# Altium schematic sheet 88路激光器工程.SchDoc: Laser Driver Board 01
size A2; Revision: V01; SheetNumber: 1; SheetTotal: 3; DocStatus: Draft
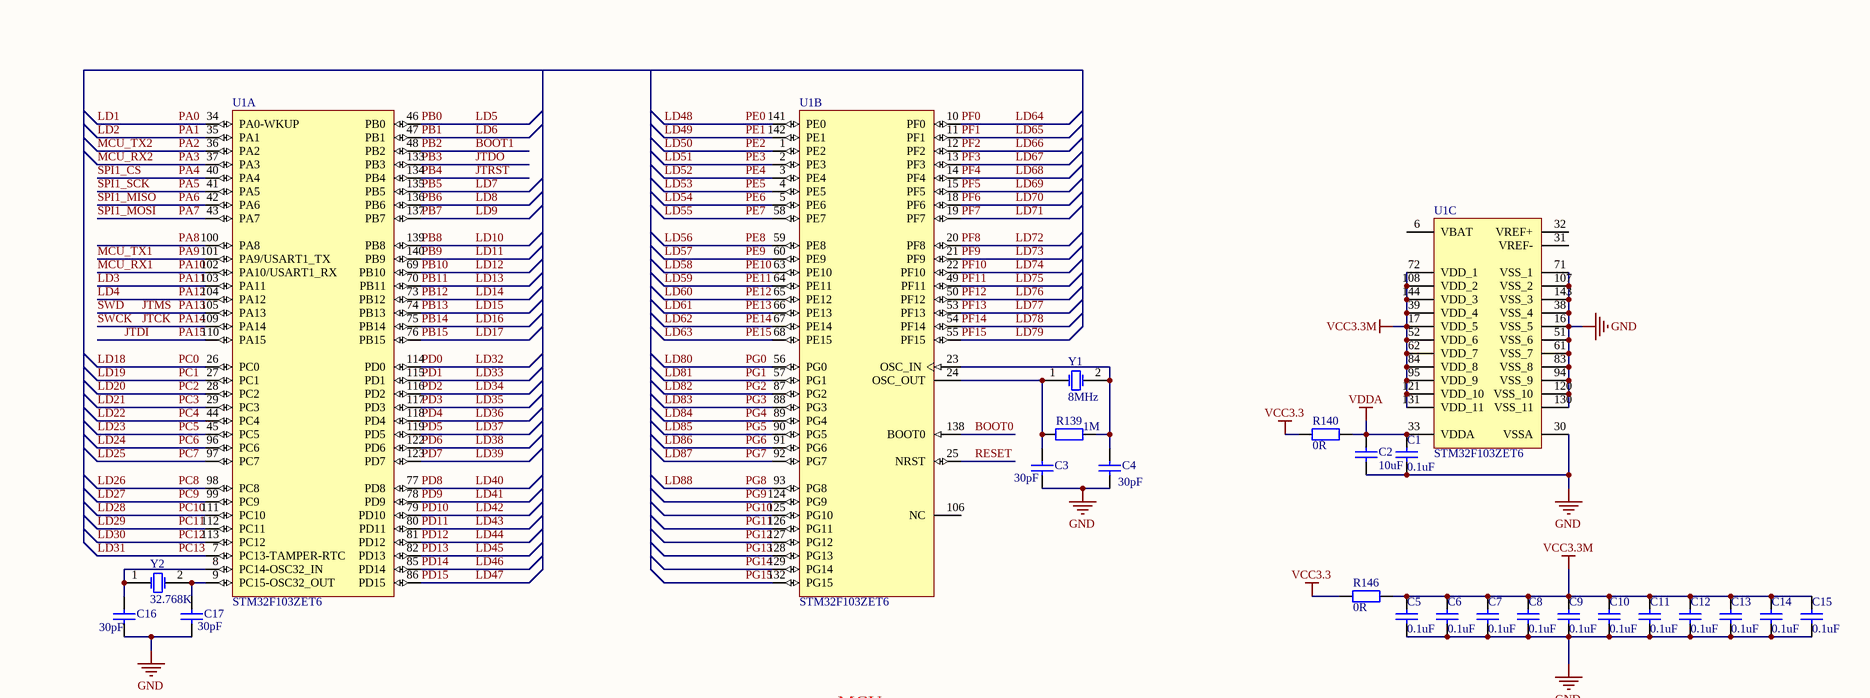
[diagram p0: 88路激光器工程.SchDoc, top left]
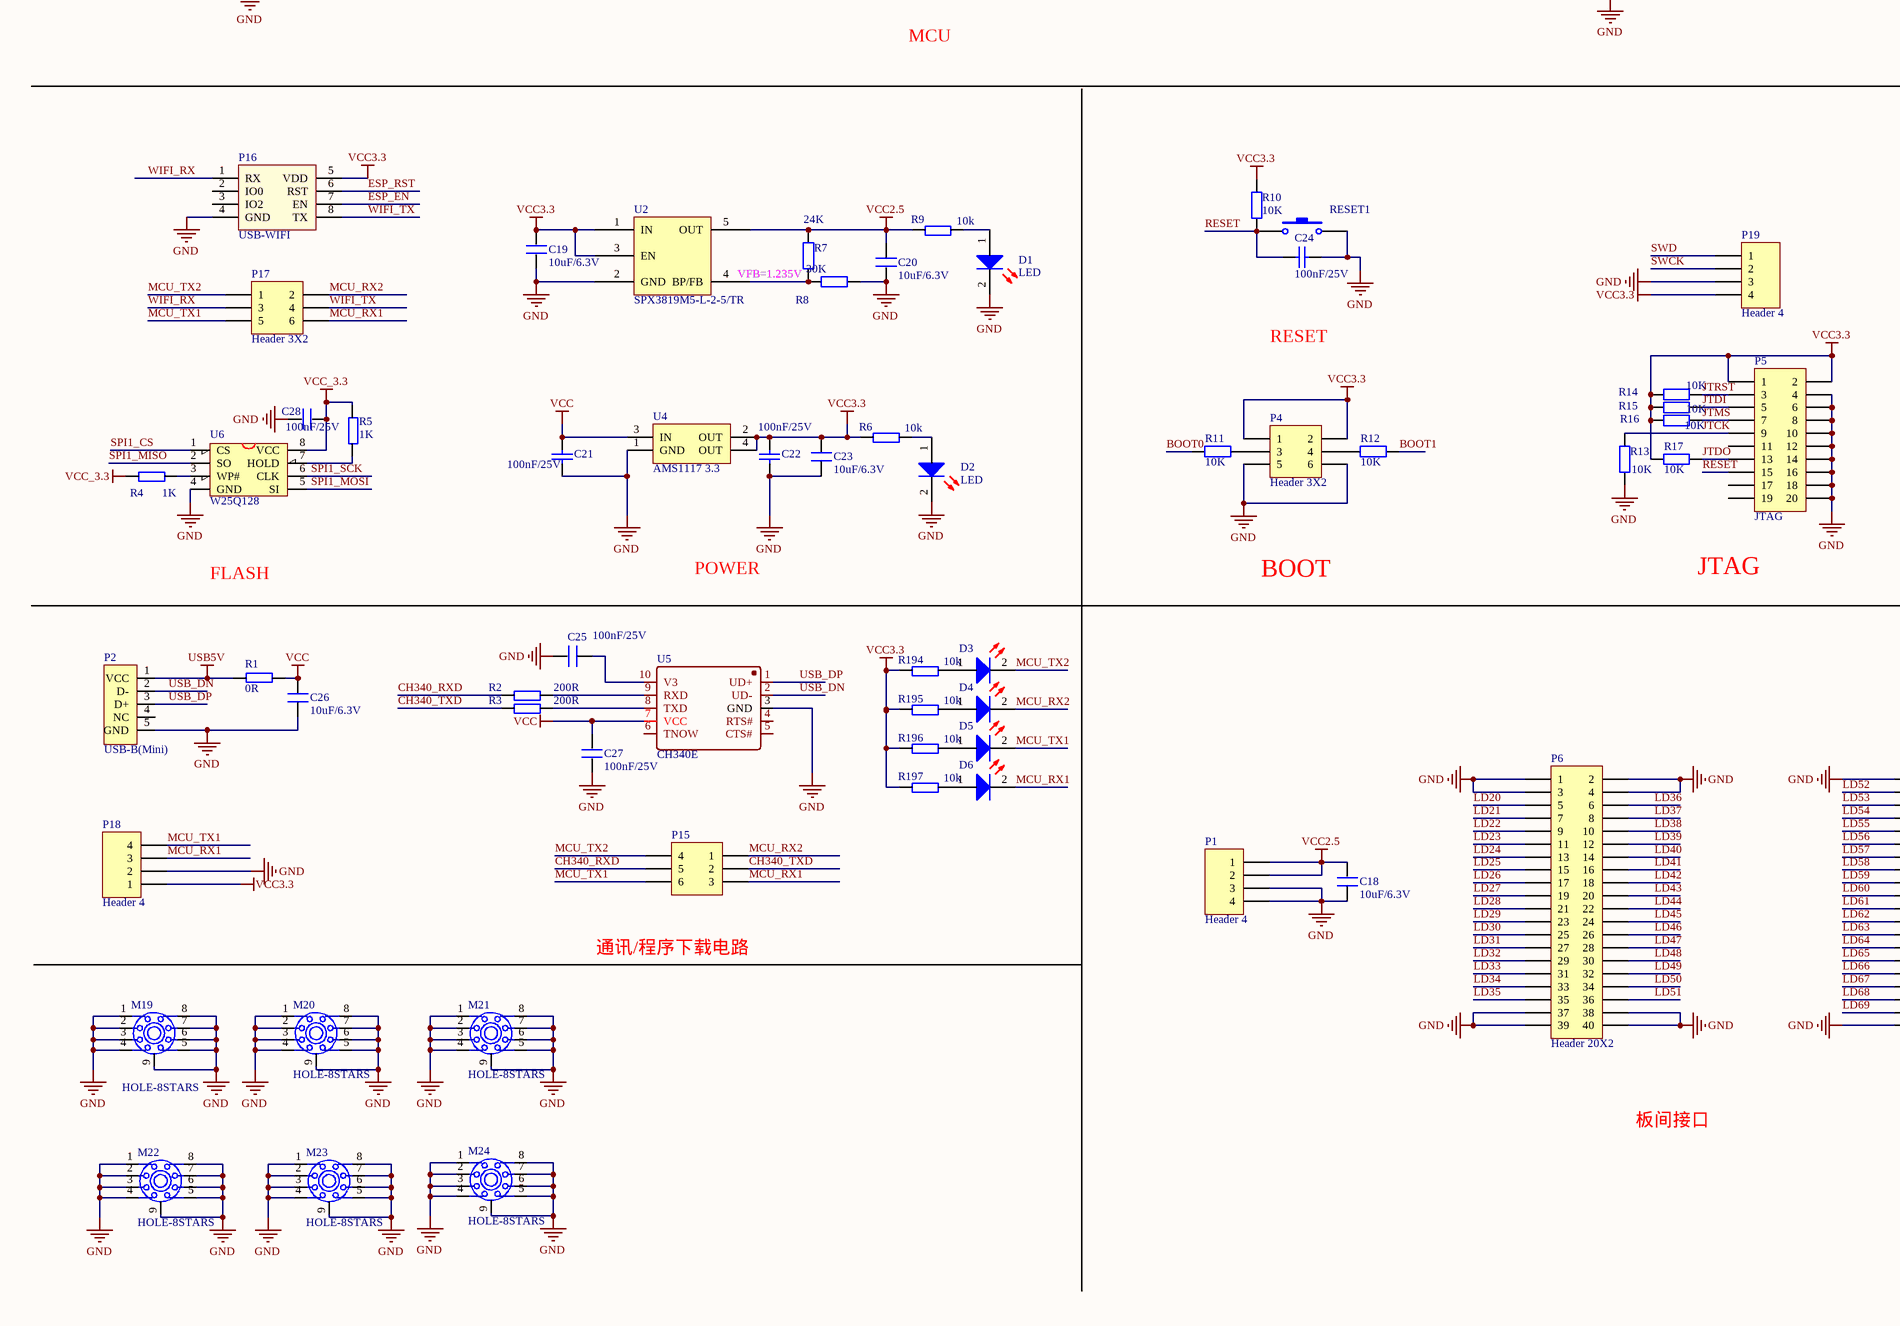
[diagram p1: 88路激光器工程.SchDoc, bottom left]
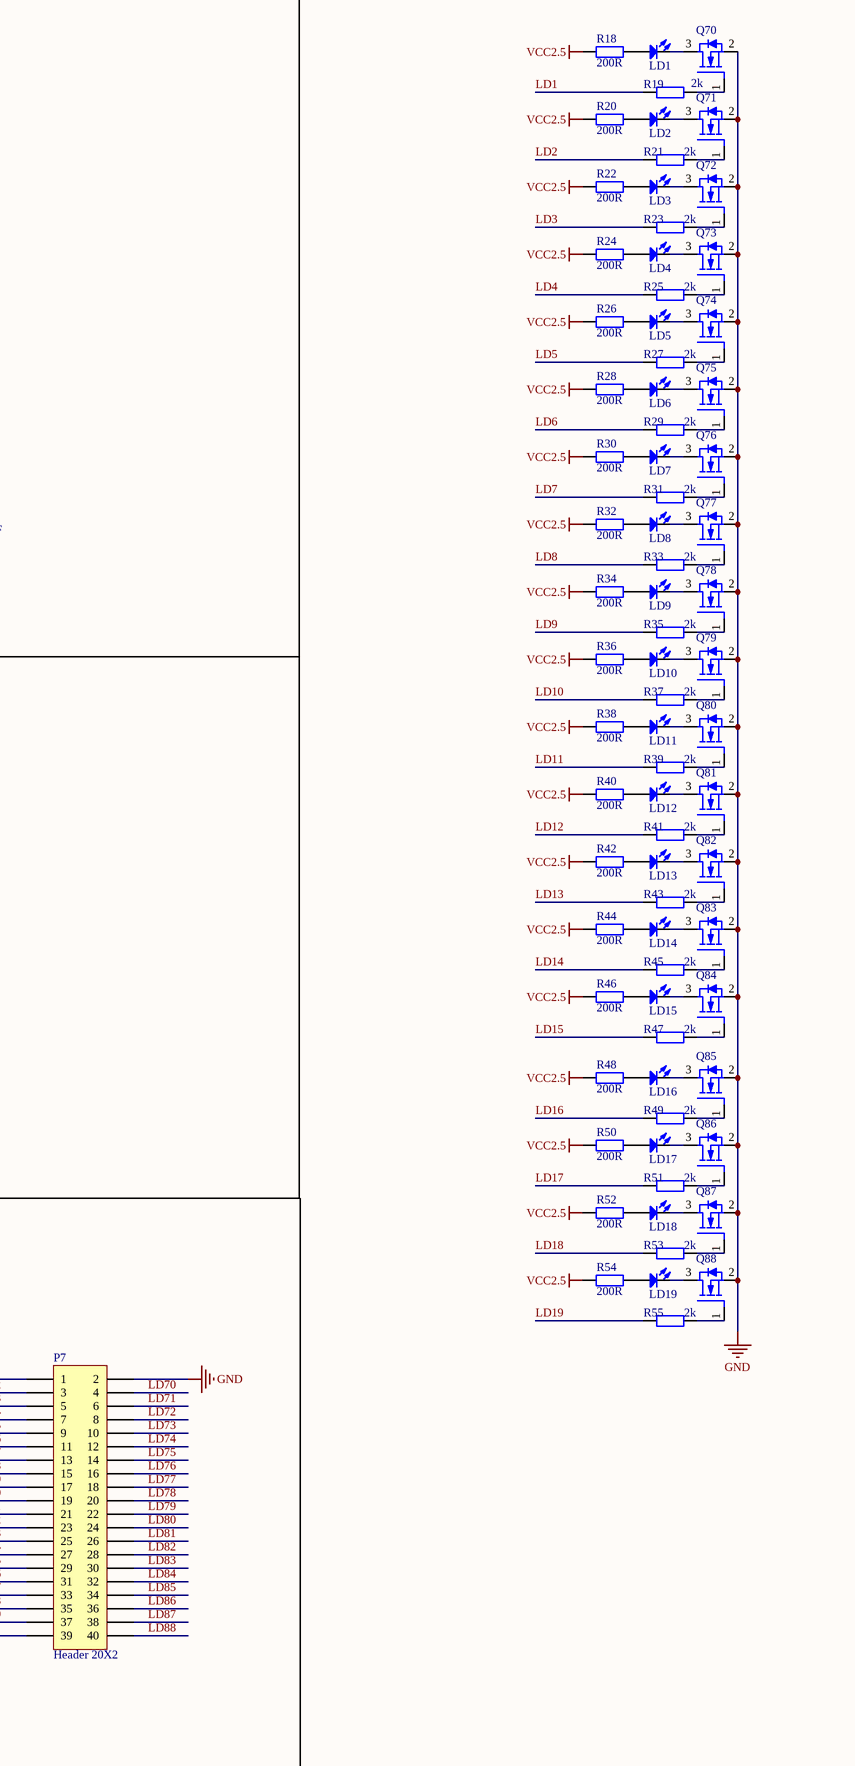
[diagram p2: 88路激光器工程.SchDoc, bottom right]

## Parts
C1  0.1uF  [C0805]
C2  10uF  [C0805]
C3  30pF  [C0805]
C4  30pF  [C0805]
C5  0.1uF  [C0805]
C6  0.1uF  [C0805]
C7  0.1uF  [C0805]
C8  0.1uF  [C0805]
C9  0.1uF  [C0805]
C10  0.1uF  [C0805]
C11  0.1uF  [C0805]
C12  0.1uF  [C0805]
C13  0.1uF  [C0805]
C14  0.1uF  [C0805]
C15  0.1uF  [C0805]
C16  30pF  [C0805]
C17  30pF  [C0805]
C18  10uF/6.3V  [C0805]
C19  10uF/6.3V  [C0805]
C20  10uF/6.3V  [C0805]
C21  100nF/25V  [C0805]
C22  100nF/25V  [C0805]
C23  10uF/6.3V  [C0805]
C24  100nF/25V  [C0805]
C25  100nF/25V  [C0805]
C26  10uF/6.3V  [C0805]
C27  100nF/25V  [C0805]
C28  100nF/25V  [C0805]
D1  LED  [LED_0805]
D2  LED  [LED_0805]
D3  LED  [LED_0805]  (value not drawn)
D4  LED  [LED_0805]  (value not drawn)
D5  LED  [LED_0805]  (value not drawn)
D6  LED  [LED_0805]  (value not drawn)
LD1  LD  [LD_3P]  (value not drawn)
LD2  LD  [LD_3P]  (value not drawn)
LD3  LD  [LD_3P]  (value not drawn)
LD4  LD  [LD_3P]  (value not drawn)
LD5  LD  [LD_3P]  (value not drawn)
LD6  LD  [LD_3P]  (value not drawn)
LD7  LD  [LD_3P]  (value not drawn)
LD8  LD  [LD_3P]  (value not drawn)
LD9  LD  [LD_3P]  (value not drawn)
LD10  LD  [LD_3P]  (value not drawn)
LD11  LD  [LD_3P]  (value not drawn)
LD12  LD  [LD_3P]  (value not drawn)
LD13  LD  [LD_3P]  (value not drawn)
LD14  LD  [LD_3P]  (value not drawn)
LD15  LD  [LD_3P]  (value not drawn)
LD16  LD  [LD_3P]  (value not drawn)
LD17  LD  [LD_3P]  (value not drawn)
LD18  LD  [LD_3P]  (value not drawn)
LD19  LD  [LD_3P]  (value not drawn)
M19  HOLE-8STARS  [HOLE_3MM]
M20  HOLE-8STARS  [HOLE_3MM]
M21  HOLE-8STARS  [HOLE_3MM]
M22  HOLE-8STARS  [HOLE_3MM]
M23  HOLE-8STARS  [HOLE_3MM]
M24  HOLE-8STARS  [HOLE_3MM]
P1  Header 4  [XH2.54MM_4P_立式]
P2  USB-B(Mini)  [MICRO_USB5P_带牛角]
P4  Header 3X2  [HDR2X3]
P5  JTAG  [JTAG_2X10P_2.54MM]
P6  Header 20X2  [JATG_2.0mm_2x20P_SMD]
P7  Header 20X2  [JATG_2.0mm_2x20P_SMD]
P15  Header 3X2A  [HDR2X3_CEN]  (value not drawn)
P16  USB-WIFI  [UART-WIFI]
P17  Header 3X2  [HDR2X3]
P18  Header 4  [HDR1X4]
P19  Header 4  [HDR1X4]
Q70  NMOS  [SOT23-3]  (value not drawn)
Q71  NMOS  [SOT23-3]  (value not drawn)
Q72  NMOS  [SOT23-3]  (value not drawn)
Q73  NMOS  [SOT23-3]  (value not drawn)
Q74  NMOS  [SOT23-3]  (value not drawn)
Q75  NMOS  [SOT23-3]  (value not drawn)
Q76  NMOS  [SOT23-3]  (value not drawn)
Q77  NMOS  [SOT23-3]  (value not drawn)
Q78  NMOS  [SOT23-3]  (value not drawn)
Q79  NMOS  [SOT23-3]  (value not drawn)
Q80  NMOS  [SOT23-3]  (value not drawn)
Q81  NMOS  [SOT23-3]  (value not drawn)
Q82  NMOS  [SOT23-3]  (value not drawn)
Q83  NMOS  [SOT23-3]  (value not drawn)
Q84  NMOS  [SOT23-3]  (value not drawn)
Q85  NMOS  [SOT23-3]  (value not drawn)
Q86  NMOS  [SOT23-3]  (value not drawn)
Q87  NMOS  [SOT23-3]  (value not drawn)
Q88  NMOS  [SOT23-3]  (value not drawn)
R1  0R  [R0805]
R2  200R  [R0805]
R3  200R  [R0805]
R4  1K  [R0805]
R5  1K  [R0805]
R6  10k  [R0805]
R7  24K  [R0805]
R8  30K  [R0805]
R9  10k  [R0805]
R10  10K  [R0805]
R11  10K  [R0805]
R12  10K  [R0805]
R13  10K  [R0805]
R14  10K  [R0805]
R15  10K  [R0805]
R16  10K  [R0805]
R17  10K  [R0805]
R18  200R  [R0805]
R19  2k  [R0805]
R20  200R  [R0805]
R21  2k  [R0805]
R22  200R  [R0805]
R23  2k  [R0805]
R24  200R  [R0805]
R25  2k  [R0805]
R26  200R  [R0805]
R27  2k  [R0805]
R28  200R  [R0805]
R29  2k  [R0805]
R30  200R  [R0805]
R31  2k  [R0805]
R32  200R  [R0805]
R33  2k  [R0805]
R34  200R  [R0805]
R35  2k  [R0805]
R36  200R  [R0805]
R37  2k  [R0805]
R38  200R  [R0805]
R39  2k  [R0805]
R40  200R  [R0805]
R41  2k  [R0805]
R42  200R  [R0805]
R43  2k  [R0805]
R44  200R  [R0805]
R45  2k  [R0805]
R46  200R  [R0805]
R47  2k  [R0805]
R48  200R  [R0805]
R49  2k  [R0805]
R50  200R  [R0805]
R51  2k  [R0805]
R52  200R  [R0805]
R53  2k  [R0805]
R54  200R  [R0805]
R55  2k  [R0805]
R139  1M  [R0805]
R140  0R  [R0805]
R146  0R  [R0805]
R194  10k  [R0805]
R195  10k  [R0805]
R196  10k  [R0805]
R197  10k  [R0805]
RESET1  SW-PB  [KEY_PB_6X6X5]  (value not drawn)
U1  STM32F103ZET6  [LQFP-144]  (parts A,B,C of 3)
U2  SPX3819M5-L-2-5/TR  [SOT23-5]
U4  AMS1117 3.3  [SOT-223]
U5  CH340E  [MSOP-10]
U6  W25Q128  [SOIC-8_208MIL]
Y1  8MHz  [HC-49S]
Y2  32.768K  [XTAL_32KHZ_TH__2P]

## Nets
GND: C1.1 C2.1 C3.1 C4.1 C5.1 C6.1 C7.1 C8.1 C9.1 C10.1 C11.1 C12.1 C13.1 C14.1 C15.1 C16.1 C17.1 C18.1 C19.1 C20.1 C21.1 C22.1 C23.1 C24.2 C25.1 C26.1 C27.1 C28.1 D1.2 D2.2 M19.1 M19.2 M19.3 M19.4 M19.5 M19.6 M19.7 M19.8 M19.9 M20.1 M20.2 M20.3 M20.4 M20.5 M20.6 M20.7 M20.8 M20.9 M21.1 M21.2 M21.3 M21.4 M21.5 M21.6 M21.7 M21.8 M21.9 M22.1 M22.2 M22.3 M22.4 M22.5 M22.6 M22.7 M22.8 M22.9 M23.1 M23.2 M23.3 M23.4 M23.5 M23.6 M23.7 M23.8 M23.9 M24.1 M24.2 M24.3 M24.4 M24.5 M24.6 M24.7 M24.8 M24.9 P1.3 P1.4 P2.5(GND) P4.5 P4.6 P5.4 P5.6 P5.8 P5.10 P5.12 P5.14 P5.16 P5.18 P5.20 P6.1 P6.2 P6.3 P6.4 P6.37 P6.38 P6.39 P6.40 P7.1 P7.2 P7.39 P16.4(GND) P18.2 P19.3 Q70.2(SOURCE) Q71.2(SOURCE) Q72.2(SOURCE) Q73.2(SOURCE) Q74.2(SOURCE) Q75.2(SOURCE) Q76.2(SOURCE) Q77.2(SOURCE) Q78.2(SOURCE) Q79.2(SOURCE) Q80.2(SOURCE) Q81.2(SOURCE) Q82.2(SOURCE) Q83.2(SOURCE) Q84.2(SOURCE) Q85.2(SOURCE) Q86.2(SOURCE) Q87.2(SOURCE) Q88.2(SOURCE) R8.1 R13.1 RESET1.2 U1.16(VSS_5) U1.30(VSSA) U1.38(VSS_4) U1.51(VSS_6) U1.61(VSS_7) U1.71(VSS_1) U1.83(VSS_8) U1.94(VSS_9) U1.107(VSS_2) U1.120(VSS_10) U1.130(VSS_11) U1.143(VSS_3) U2.2(GND) U4.1(GND) U5.3(GND) U6.4(GND)
USB5V: P2.1(VCC) R1.2
VCC: C21.2 C26.2 C27.2 R1.1 U4.3(IN) U5.7(VCC)
VCC2.5: C18.2 C20.2 P1.1 P1.2 R7.2 R9.1 R18.2 R20.2 R22.2 R24.2 R26.2 R28.2 R30.2 R32.2 R34.2 R36.2 R38.2 R40.2 R42.2 R44.2 R46.2 R48.2 R50.2 R52.2 R54.2 U2.5(OUT)
VCC3.3: C19.2 C22.2 C23.2 P4.1 P4.2 P5.1 P5.2 P16.5(VDD) P18.1 P19.4 R6.1 R10.2 R14.1 R15.1 R16.1 R17.1 R140.1 R146.1 R194.1 R195.1 R196.1 R197.1 U2.1(IN) U2.3(EN) U4.2(OUT) U4.4(OUT)
VCC3.3M: C5.2 C6.2 C7.2 C8.2 C9.2 C10.2 C11.2 C12.2 C13.2 C14.2 C15.2 R146.2 U1.17(VDD_5) U1.39(VDD_4) U1.52(VDD_6) U1.62(VDD_7) U1.72(VDD_1) U1.84(VDD_8) U1.95(VDD_9) U1.108(VDD_2) U1.121(VDD_10) U1.131(VDD_11) U1.144(VDD_3)
VCC_3.3: C28.2 R4.1 R5.2 U6.8(VCC)
VDDA: C1.2 C2.2 R140.2 U1.33(VDDA)
BOOT0: R11.1 U1.138(BOOT0)
BOOT1: R12.2 U1.48(PB2)  [also labelled PB2]
CH340_RXD: P15.5 R2.1
CH340_TXD: P15.2 R3.1
ESP_EN: P16.7(EN)
ESP_RST: P16.6(RST)
JTCK: P5.9 P19.2 R13.2 U1.109(PA14)  [also labelled PA14, SWCK]
JTDI: P5.5 R15.2 U1.110(PA15)  [also labelled PA15]
JTDO: P5.13 R17.2 U1.133(PB3)  [also labelled PB3]
JTMS: P5.7 P19.1 R16.2 U1.105(PA13)  [also labelled PA13, SWD]
JTRST: P5.3 R14.2 U1.134(PB4)  [also labelled PB4]
LD1: R19.2 U1.34(PA0-WKUP)  [also labelled PA0]
LD2: R21.2 U1.35(PA1)  [also labelled PA1]
LD3: R23.2 U1.103(PA11)  [also labelled PA11]
LD4: R25.2 U1.104(PA12)  [also labelled PA12]
LD5: R27.2 U1.46(PB0)  [also labelled PB0]
LD6: R29.2 U1.47(PB1)  [also labelled PB1]
LD7: R31.2 U1.135(PB5)  [also labelled PB5]
LD8: R33.2 U1.136(PB6)  [also labelled PB6]
LD9: R35.2 U1.137(PB7)  [also labelled PB7]
LD10: R37.2 U1.139(PB8)  [also labelled PB8]
LD11: R39.2 U1.140(PB9)  [also labelled PB9]
LD12: R41.2 U1.69(PB10)  [also labelled PB10]
LD13: R43.2 U1.70(PB11)  [also labelled PB11]
LD14: R45.2 U1.73(PB12)  [also labelled PB12]
LD15: R47.2 U1.74(PB13)  [also labelled PB13]
LD16: R49.2 U1.75(PB14)  [also labelled PB14]
LD17: R51.2 U1.76(PB15)  [also labelled PB15]
LD18: R53.2 U1.26(PC0)  [also labelled PC0]
LD19: R55.2 U1.27(PC1)  [also labelled PC1]
LD20: P6.5 U1.28(PC2)  [also labelled PC2]
LD21: P6.7 U1.29(PC3)  [also labelled PC3]
LD22: P6.9 U1.44(PC4)  [also labelled PC4]
LD23: P6.11 U1.45(PC5)  [also labelled PC5]
LD24: P6.13 U1.96(PC6)  [also labelled PC6]
LD25: P6.15 U1.97(PC7)  [also labelled PC7]
LD26: P6.17 U1.98(PC8)  [also labelled PC8]
LD27: P6.19 U1.99(PC9)  [also labelled PC9]
LD28: P6.21 U1.111(PC10)  [also labelled PC10]
LD29: P6.23 U1.112(PC11)  [also labelled PC11]
LD30: P6.25 U1.113(PC12)  [also labelled PC12]
LD31: P6.27 U1.7(PC13-TAMPER-RTC)  [also labelled PC13]
LD32: P6.29 U1.114(PD0)  [also labelled PD0]
LD33: P6.31 U1.115(PD1)  [also labelled PD1]
LD34: P6.33 U1.116(PD2)  [also labelled PD2]
LD35: P6.35 U1.117(PD3)  [also labelled PD3]
LD36: P6.6 U1.118(PD4)  [also labelled PD4]
LD37: P6.8 U1.119(PD5)  [also labelled PD5]
LD38: P6.10 U1.122(PD6)  [also labelled PD6]
LD39: P6.12 U1.123(PD7)  [also labelled PD7]
LD40: P6.14 U1.77(PD8)  [also labelled PD8]
LD41: P6.16 U1.78(PD9)  [also labelled PD9]
LD42: P6.18 U1.79(PD10)  [also labelled PD10]
LD43: P6.20 U1.80(PD11)  [also labelled PD11]
LD44: P6.22 U1.81(PD12)  [also labelled PD12]
LD45: P6.24 U1.82(PD13)  [also labelled PD13]
LD46: P6.26 U1.85(PD14)  [also labelled PD14]
LD47: P6.28 U1.86(PD15)  [also labelled PD15]
LD48: P6.30 U1.141(PE0)  [also labelled PE0]
LD49: P6.32 U1.142(PE1)  [also labelled PE1]
LD50: P6.34 U1.1(PE2)  [also labelled PE2]
LD51: P6.36 U1.2(PE3)  [also labelled PE3]
LD52: P7.3 U1.3(PE4)  [also labelled PE4]
LD53: P7.5 U1.4(PE5)  [also labelled PE5]
LD54: P7.7 U1.5(PE6)  [also labelled PE6]
LD55: P7.9 U1.58(PE7)  [also labelled PE7]
LD56: P7.11 U1.59(PE8)  [also labelled PE8]
LD57: P7.13 U1.60(PE9)  [also labelled PE9]
LD58: P7.15 U1.63(PE10)  [also labelled PE10]
LD59: P7.17 U1.64(PE11)  [also labelled PE11]
LD60: P7.19 U1.65(PE12)  [also labelled PE12]
LD61: P7.21 U1.66(PE13)  [also labelled PE13]
LD62: P7.23 U1.67(PE14)  [also labelled PE14]
LD63: P7.25 U1.68(PE15)  [also labelled PE15]
LD64: P7.27 U1.10(PF0)  [also labelled PF0]
LD65: P7.29 U1.11(PF1)  [also labelled PF1]
LD66: P7.31 U1.12(PF2)  [also labelled PF2]
LD67: P7.33 U1.13(PF3)  [also labelled PF3]
LD68: P7.35 U1.14(PF4)  [also labelled PF4]
LD69: P7.37 U1.15(PF5)  [also labelled PF5]
LD70: P7.4 U1.18(PF6)  [also labelled PF6]
LD71: P7.6 U1.19(PF7)  [also labelled PF7]
LD72: P7.8 U1.20(PF8)  [also labelled PF8]
LD73: P7.10 U1.21(PF9)  [also labelled PF9]
LD74: P7.12 U1.22(PF10)  [also labelled PF10]
LD75: P7.14 U1.49(PF11)  [also labelled PF11]
LD76: P7.16 U1.50(PF12)  [also labelled PF12]
LD77: P7.18 U1.53(PF13)  [also labelled PF13]
LD78: P7.20 U1.54(PF14)  [also labelled PF14]
LD79: P7.22 U1.55(PF15)  [also labelled PF15]
LD80: P7.24 U1.56(PG0)  [also labelled PG0]
LD81: P7.26 U1.57(PG1)  [also labelled PG1]
LD82: P7.28 U1.87(PG2)  [also labelled PG2]
LD83: P7.30 U1.88(PG3)  [also labelled PG3]
LD84: P7.32 U1.89(PG4)  [also labelled PG4]
LD85: P7.34 U1.90(PG5)  [also labelled PG5]
LD86: P7.36 U1.91(PG6)  [also labelled PG6]
LD87: P7.38 U1.92(PG7)  [also labelled PG7]
LD88: P7.40 U1.93(PG8)  [also labelled PG8]
MCU_RX1: D6.2 P15.3 P17.6 P18.3 U1.102(PA10/USART1_RX)  [also labelled PA10]
MCU_RX2: D4.2 P15.1 P17.2 U1.37(PA3)  [also labelled PA3]
MCU_TX1: D5.2 P15.6 P17.5 P18.4 U1.101(PA9/USART1_TX)  [also labelled PA9]
MCU_TX2: D3.2 P15.4 P17.1 U1.36(PA2)  [also labelled PA2]
PA4: U1.40(PA4) U6.1(CS)  [also labelled SPI1_CS]
PA5: U1.41(PA5) U6.6(CLK)  [also labelled SPI1_SCK]
PA6: U1.42(PA6) U6.2(SO)  [also labelled SPI1_MISO]
PA7: U1.43(PA7) U6.5(SI)  [also labelled SPI1_MOSI]
PA8: U1.100(PA8)
PG9: U1.124(PG9)
PG10: U1.125(PG10)
PG11: U1.126(PG11)
PG12: U1.127(PG12)
PG13: U1.128(PG13)
PG14: U1.129(PG14)
PG15: U1.132(PG15)
RESET: C24.1 P5.15 R10.1 RESET1.1 U1.25(NRST)
USB_DN: P2.2(D-) U5.2(UD-)
USB_DP: P2.3(D+) U5.1(UD+)
WIFI_RX: P16.1(RX) P17.3
WIFI_TX: P16.8(TX) P17.4
NetC3_2: C3.2 R139.1 U1.24(OSC_OUT) Y1.1(OSC1)
NetC4_2: C4.2 R139.2 U1.23(OSC_IN) Y1.2(OSC2)
NetC16_2: C16.2 U1.8(PC14-OSC32_IN) Y2.1(OSC1)
NetC17_2: C17.2 U1.9(PC15-OSC32_OUT) Y2.2(OSC2)
NetC25_2: C25.2 U5.10(V3)
NetD1_1: D1.1 R9.2
NetD2_1: D2.1 R6.2
NetD3_1: D3.1 R194.2
NetD4_1: D4.1 R195.2
NetD5_1: D5.1 R196.2
NetD6_1: D6.1 R197.2
NetLD1_1: LD1.1(A) R18.1
NetLD1_2: LD1.2(K) Q70.3(DRAIN)
NetLD2_1: LD2.1(A) R20.1
NetLD2_2: LD2.2(K) Q71.3(DRAIN)
NetLD3_1: LD3.1(A) R22.1
NetLD3_2: LD3.2(K) Q72.3(DRAIN)
NetLD4_1: LD4.1(A) R24.1
NetLD4_2: LD4.2(K) Q73.3(DRAIN)
NetLD5_1: LD5.1(A) R26.1
NetLD5_2: LD5.2(K) Q74.3(DRAIN)
NetLD6_1: LD6.1(A) R28.1
NetLD6_2: LD6.2(K) Q75.3(DRAIN)
NetLD7_1: LD7.1(A) R30.1
NetLD7_2: LD7.2(K) Q76.3(DRAIN)
NetLD8_1: LD8.1(A) R32.1
NetLD8_2: LD8.2(K) Q77.3(DRAIN)
NetLD9_1: LD9.1(A) R34.1
NetLD9_2: LD9.2(K) Q78.3(DRAIN)
NetLD10_1: LD10.1(A) R36.1
NetLD10_2: LD10.2(K) Q79.3(DRAIN)
NetLD11_1: LD11.1(A) R38.1
NetLD11_2: LD11.2(K) Q80.3(DRAIN)
NetLD12_1: LD12.1(A) R40.1
NetLD12_2: LD12.2(K) Q81.3(DRAIN)
NetLD13_1: LD13.1(A) R42.1
NetLD13_2: LD13.2(K) Q82.3(DRAIN)
NetLD14_1: LD14.1(A) R44.1
NetLD14_2: LD14.2(K) Q83.3(DRAIN)
NetLD15_1: LD15.1(A) R46.1
NetLD15_2: LD15.2(K) Q84.3(DRAIN)
NetLD16_1: LD16.1(A) R48.1
NetLD16_2: LD16.2(K) Q85.3(DRAIN)
NetLD17_1: LD17.1(A) R50.1
NetLD17_2: LD17.2(K) Q86.3(DRAIN)
NetLD18_1: LD18.1(A) R52.1
NetLD18_2: LD18.2(K) Q87.3(DRAIN)
NetLD19_1: LD19.1(A) R54.1
NetLD19_2: LD19.2(K) Q88.3(DRAIN)
NetP4_3: P4.3 R11.2
NetP4_4: P4.4 R12.1
NetQ70_1: Q70.1(GATE) R19.1
NetQ71_1: Q71.1(GATE) R21.1
NetQ72_1: Q72.1(GATE) R23.1
NetQ73_1: Q73.1(GATE) R25.1
NetQ74_1: Q74.1(GATE) R27.1
NetQ75_1: Q75.1(GATE) R29.1
NetQ76_1: Q76.1(GATE) R31.1
NetQ77_1: Q77.1(GATE) R33.1
NetQ78_1: Q78.1(GATE) R35.1
NetQ79_1: Q79.1(GATE) R37.1
NetQ80_1: Q80.1(GATE) R39.1
NetQ81_1: Q81.1(GATE) R41.1
NetQ82_1: Q82.1(GATE) R43.1
NetQ83_1: Q83.1(GATE) R45.1
NetQ84_1: Q84.1(GATE) R47.1
NetQ85_1: Q85.1(GATE) R49.1
NetQ86_1: Q86.1(GATE) R51.1
NetQ87_1: Q87.1(GATE) R53.1
NetQ88_1: Q88.1(GATE) R55.1
NetR2_2: R2.2 U5.9(RXD)
NetR3_2: R3.2 U5.8(TXD)
NetR4_2: R4.2 U6.3(WP#)
NetR5_1: R5.1 U6.7(HOLD)
NetR7_1: R7.1 R8.2 U2.4(BP/FB)

Not connected (* = marked no-connect by the designer): P2 4(NC); P5 11 17 19; P16 2(IO0) 3(IO2); U1 6(VBAT) 31(VREF-) 32(VREF+) 106(NC); U5 4(RTS#) 5(CTS#) 6(TNOW)

## Notes on the sheet
- MCU
- (near R7) VFB=1.235V
- RESET
- FLASH
- POWER
- BOOT
- JTAG
- 通讯/程序下载电路
- 板间接口
- Title
- Status
- Rev
- Date
- Sheet
- of

## Library data of the parts
C1 C5-C15 C21 C22 C24 = Cap: Capacitor; Value: 104; Published: 8-Jun-2000; LatestRevisionDate: 17-Jul-2002; LatestRevisionNote: Re-released for DXP Platform.; PackageReference: RAD-0.3; Publisher: Altium Limited; PackageDescription: Radial Cap, Thru-Hole; 2 Leads; 0.3 in Pin Spacing
C2-C4 C16 C17 = Cap: Capacitor; Published: 8-Jun-2000; LatestRevisionDate: 17-Jul-2002; LatestRevisionNote: Re-released for DXP Platform.; PackageReference: RAD-0.3; Publisher: Altium Limited; PackageDescription: Radial Cap, Thru-Hole; 2 Leads; 0.3 in Pin Spacing
  C2: Value: 10uF
  C3 C4 C16 C17: Value: 30pF
C18-C20 C23 C25-C28 = C
D1-D6 = LED_IR: 0603 无色透明 λp=940nm VR=5V VF(typ)=1.2V IF=65mA PD=130mW
P1 P18 P19 = Header 4: Header, 4-Pin; LatestRevisionDate: 17-Jul-2002; LatestRevisionNote: Re-released for DXP Platform.; Publisher: Altium Limited
P2 = USB5
P4 P17 = Header 3X2: Header, 3-Pin, Dual row; LatestRevisionDate: 17-Jul-2002; LatestRevisionNote: Re-released for DXP Platform.; Publisher: Altium Limited
P5 = Header 10X2: Header, 10-Pin, Dual row; LatestRevisionDate: 17-Jul-2002; LatestRevisionNote: Re-released for DXP Platform.; Publisher: Altium Limited
P6 P7 = Header 20X2: Header, 20-Pin, Dual row; LatestRevisionDate: 17-Jul-2002; LatestRevisionNote: Re-released for DXP Platform.; Publisher: Altium Limited
P15 = Header 3X2A: Header, 3-Pin, Dual row; LatestRevisionDate: 17-Jul-2002; LatestRevisionNote: Re-released for DXP Platform.; Publisher: Altium Limited
R1-R6 R9 R194-R197 = R
R7 R8 = Res2: Resistor; Value: NC/10K; Published: 8-Jun-2000; LatestRevisionDate: 17-Jul-2002; LatestRevisionNote: Re-released for DXP Platform.; PackageReference: AXIAL-0.4; Publisher: Altium Limited; PackageDescription: Axial Device, Thru-Hole; 2 Leads; 0.4 in Pin Spacing
R10-R55 R139 R140 R146 = Res2: Resistor; Published: 8-Jun-2000; LatestRevisionDate: 17-Jul-2002; LatestRevisionNote: Re-released for DXP Platform.; PackageReference: AXIAL-0.4; Publisher: Altium Limited; PackageDescription: Axial Device, Thru-Hole; 2 Leads; 0.4 in Pin Spacing
  R10-R17: Value: 10K
  R18 R20 R22 R24 R26 R28 R30 R32 R34 R36 R38 R40 R42 R44 R46 R48 R50 R52 R54: Value: 200R
  R19 R21 R23 R25 R27 R29 R31 R33 R35 R37 R39 R41 R43 R45 R47 R49 R51 R53 R55: Value: 2k
  R139: Value: 1M
  R140 R146: Value: 0R
RESET1 = SW-PB: Switch; Published: 24-Mar-1999; LatestRevisionDate: 17-Jul-2002; LatestRevisionNote: Re-released for DXP Platform.; PackageReference: SPST-2; Publisher: Altium Limited; PackageDescription: Switch; 2 Leads
U1 = STM32F103ZET6: ARM Cortex-M3 32-bit MCU, 512 KB Flash, 64 KB Internal RAM, 112 I/Os, 144-pin LQFP, -40 to 85 degC, Tray
U2 = SPX3819M5-L-1-2/TR: 500mA Low-Noise LDO Voltage Regulator; Manufacture: EXTR; ID: 110900015; Value: SPX3819M5-L-1-2/TR; Order No: SPX3819M5-L-1-2/TR
U4 = REG1117-3.3: 800mA and 1A Low Dropout Positive Regulator 2.85V, 3.3V, 5V, and Adjustable; Published: 8-Jun-2000; LatestRevisionDate: 17-Jul-2002; LatestRevisionNote: Re-released for DXP Platform.; DatasheetVersion: Sep-1997; PackageVersion: revC; PackageReference: ZZ311; Publisher: Altium Limited; PackageDescription: SOT-223/SC-73; 4 Leads; Body 6.7 x 7.3 mm, inc. leads (LxW max); ComponentLink1Description: Manufacturer Link; ComponentLink1URL: http://www.ti.com/; ComponentLink2Description: Datasheet; ComponentLink2URL: http://www-s.ti.com/sc/ds/REG1117.pdf
U6 = W25X16: W25X16;SST25VF016;MX25L1605
Y1 Y2 = XTAL: Crystal Oscillator; Published: 8-Jun-2000; LatestRevisionDate: 17-Jul-2002; LatestRevisionNote: Re-released for DXP Platform.; PackageReference: R38; Publisher: Altium Limited; PackageDescription: Crystal, Thru-Hole; 2 Leads; Body 3.1 x 8.2 mm (Dia.xH)